# EAGLE design TPS65217A Evaluation Board (EAGLE 9.3.0)
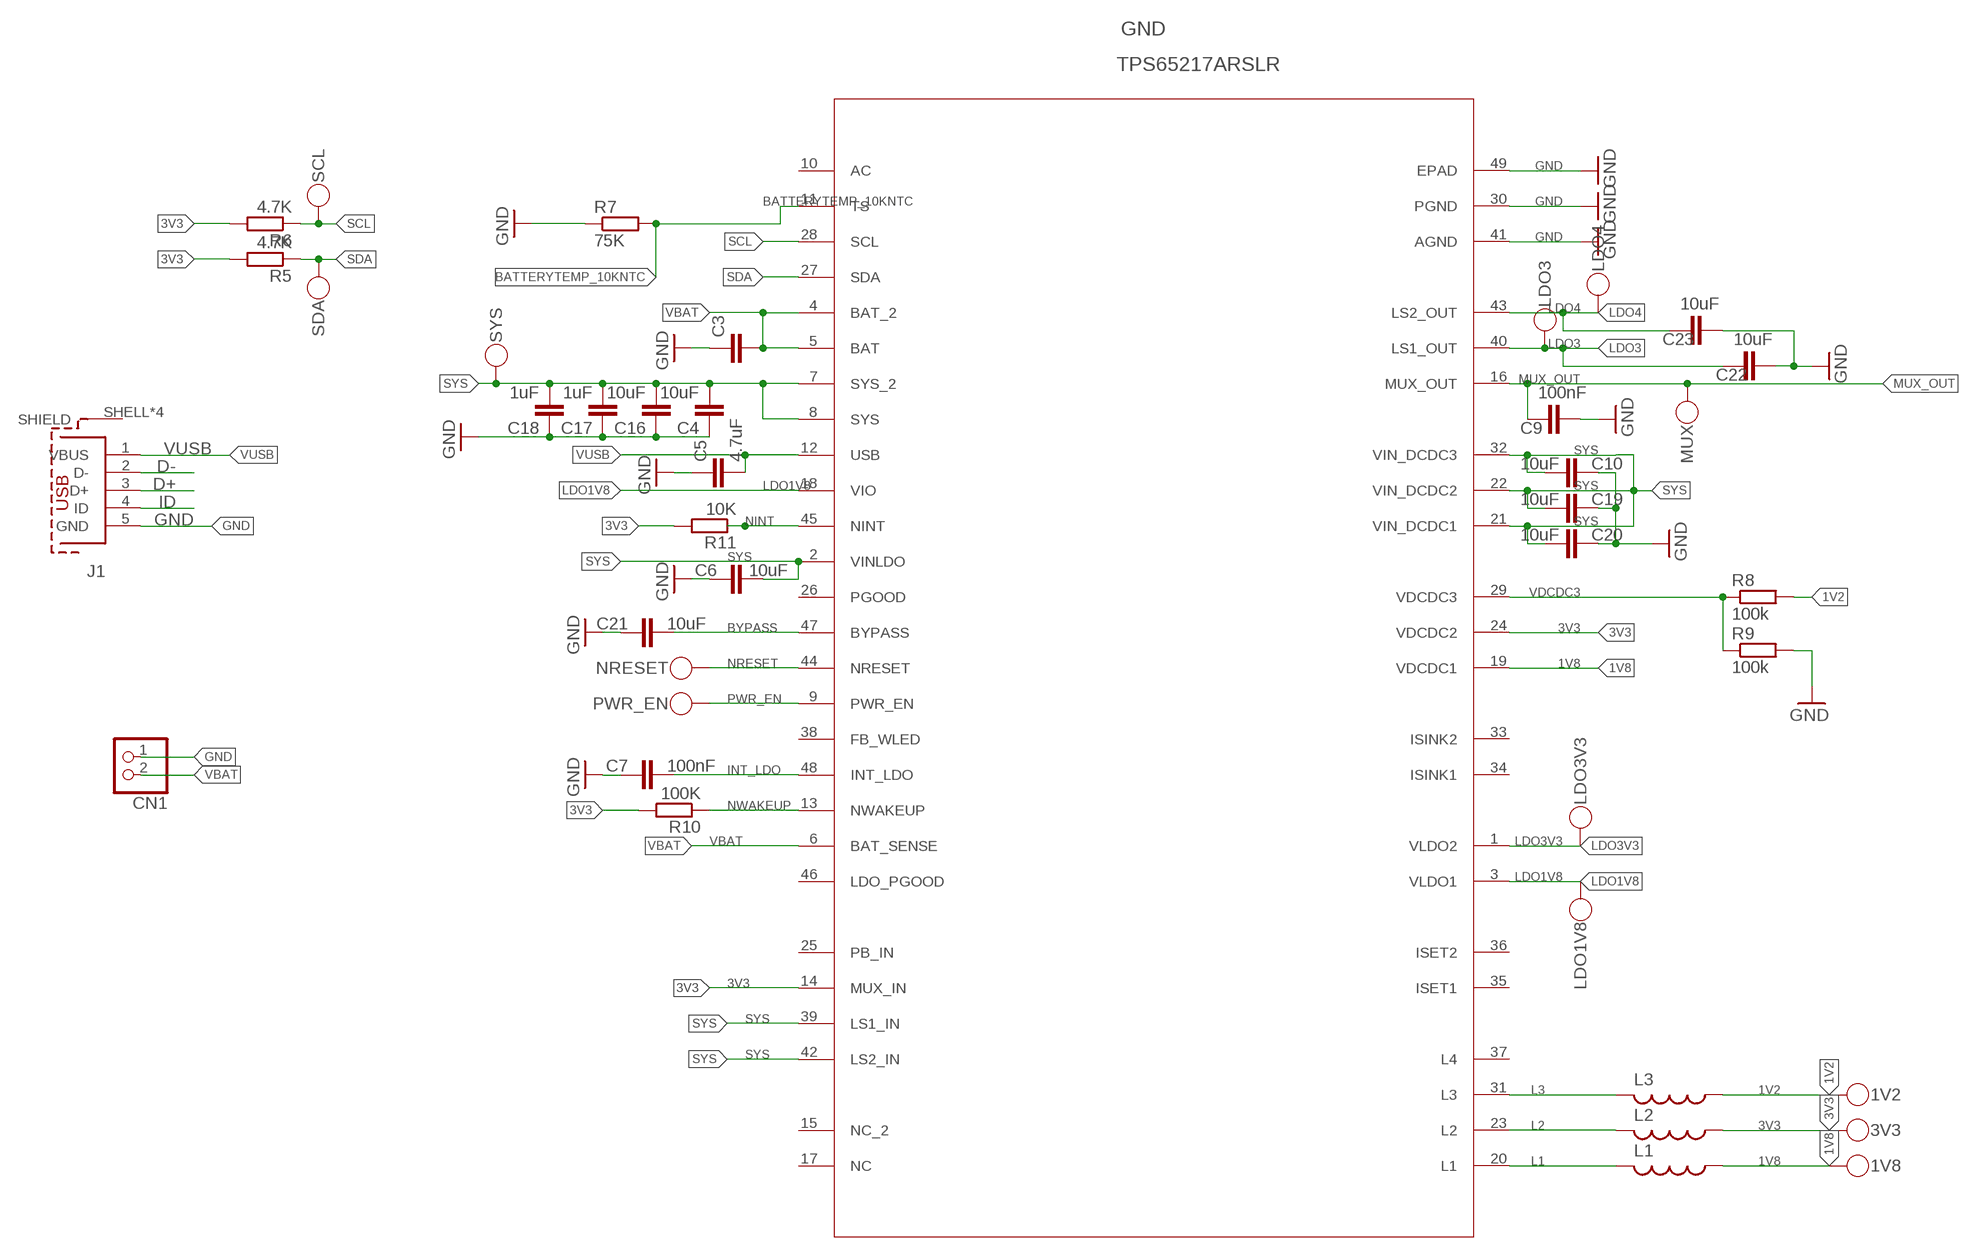
[diagram p0: schematic, sheet 1]

## Parts
1V2  TEST_TESTPOINT  [TEST_TESTPOINT]
1V8  TEST_TESTPOINT  [TEST_TESTPOINT]
3V3  TEST_TESTPOINT  [TEST_TESTPOINT]
C3  C0603  [C0603]
C4  10uF  C0603  [C0603]
C5  4.7uF  C0603  [C0603]
C6  10uF  C0603  [C0603]
C7  100nF  C0603  [C0603]
C9  100nF  C0603  [C0603]
C10  10uF  C0603  [C0603]
C16  10uF  C0603  [C0603]
C17  1uF  C0603  [C0603]
C18  1uF  C0603  [C0603]
C19  10uF  C0603  [C0603]
C20  10uF  C0603  [C0603]
C21  10uF  C0603  [C0603]
C22  10uF  C0603  [C0603]
C23  10uF  C0603  [C0603]
CN1  JST_2PIN-SMT-RA  [JST-PH-2-SMT-RA]
GND  TPS65217ARSLR  [RSL48_4P05X4P05]
J1  629105150521  [629105150521]
L1  L4X4  [ASPI-4030S-253675]
L2  L4X4  [ASPI-4030S-253675]
L3  L4X4  [ASPI-4030S-253675]
LDO1V8  TEST_TESTPOINT  [TEST_TESTPOINT]
LDO3  TEST_TESTPOINT  [TEST_TESTPOINT]
LDO3V3  TEST_TESTPOINT  [TEST_TESTPOINT]
LDO4  TEST_TESTPOINT  [TEST_TESTPOINT]
MUX  TEST_TESTPOINT  [TEST_TESTPOINT]
NRESET  TEST_TESTPOINT  [TEST_TESTPOINT]
PWR_EN  TEST_TESTPOINT  [TEST_TESTPOINT]
R5  4.7K  R0603  [R0603]
R6  4.7K  R0603  [R0603]
R7  75K  R0603  [R0603]
R8  100k  R0603  [R0603]
R9  100k  R0603  [R0603]
R10  100K  R0603  [R0603]
R11  10K  R0603  [R0603]
SCL  TEST_TESTPOINT  [TEST_TESTPOINT]
SDA  TEST_TESTPOINT  [TEST_TESTPOINT]
SYS  TEST_TESTPOINT  [TEST_TESTPOINT]

## Nets
1V2: 1V2.1 L3.P$1 R8.2
1V8: 1V8.1 GND.19(VDCDC1) L1.P$1
3V3: 3V3.1 GND.14(MUX_IN) GND.24(VDCDC2) L2.P$1 R5.2 R6.2 R10.2 R11.2
BATTERYTEMP_10KNTC: GND.11(TS) R7.2
BYPASS: C21.2 GND.47(BYPASS)
D+: J1.3(D+)
D-: J1.2(D-)
GND: C3.1 C4.1 C5.1 C6.1 C7.1 C9.1 C10.1 C16.1 C17.1 C18.1 C19.1 C20.1 C21.1 C22.1 C23.1 CN1.1 GND.30(PGND) GND.41(AGND) GND.49(EPAD) J1.5(GND) R7.1 R9.2
ID: J1.4(ID)
INT_LDO: C7.2 GND.48(INT_LDO)
L1: GND.20(L1) L1.P$2
L2: GND.23(L2) L2.P$2
L3: GND.31(L3) L3.P$2
LDO1V8: GND.3(VLDO1) GND.18(VIO) LDO1V8.1
LDO3: C22.2 GND.40(LS1_OUT) LDO3.1
LDO3V3: GND.1(VLDO2) LDO3V3.1
LDO4: C23.2 GND.43(LS2_OUT) LDO4.1
MUX_OUT: C9.2 GND.16(MUX_OUT) MUX.1
NINT: GND.45(NINT) R11.1
NRESET: GND.44(NRESET) NRESET.1
NWAKEUP: GND.13(NWAKEUP) R10.1
PWR_EN: GND.9(PWR_EN) PWR_EN.1
SCL: GND.28(SCL) R6.1 SCL.1
SDA: GND.27(SDA) R5.1 SDA.1
SYS: C4.2 C6.2 C10.2 C16.2 C17.2 C18.2 C19.2 C20.2 GND.2(VINLDO) GND.7(SYS_2) GND.8(SYS) GND.21(VIN_DCDC1) GND.22(VIN_DCDC2) GND.32(VIN_DCDC3) GND.39(LS1_IN) GND.42(LS2_IN) SYS.1
VBAT: C3.2 CN1.2 GND.4(BAT_2) GND.5(BAT) GND.6(BAT_SENSE)
VDCDC3: GND.29(VDCDC3) R8.1 R9.1
VUSB: C5.2 GND.12(USB) J1.1(VBUS)
Unconnected: GND.10(AC) GND.15(NC_2) GND.17(NC) GND.25(PB_IN) GND.26(PGOOD) GND.33(ISINK2) GND.34(ISINK1) GND.35(ISET1) GND.36(ISET2) GND.37(L4) GND.38(FB_WLED) GND.46(LDO_PGOOD) J1.SHELL1(SHIELD) J1.SHELL2(SHIELD) J1.SHELL3(SHIELD) J1.SHELL(SHIELD)

## Library data of the parts
1V2 1V8 3V3 LDO1V8 LDO3 LDO3V3 LDO4 MUX NRESET PWR_EN SCL SDA SYS = marius:TEST_TESTPOINT; X: X
C3-C7 C9 C10 C16-C23 = marius:C: Capacitor SMD
CN1 = adafruit:JST_2PIN: JST 2-Pin Connectors of various flavors SMT-RA (S2B-PH-SM4) 4UConnector #17311 SMT (B2B-PH-SM4) THM-RA (S2B-PH) THM (B2B-PH)
GND = iframe:TPS65217ARSLR; MANUFACTURER_PART_NUMBER: TPS65217ARSLR; VENDOR: Texas Instruments
J1 = InputOutputIO (rev19a):629105150521: WR-COM_USB_Micro Type B_Horizontal_SMT ; Micro Type B Horizontal SMT - 3A current at Pin1 & Pin 5 - with Pegs and THT shielding Pins - T&R Packaging Code : Con_I-O_COM_USB_2.0_B_629105150521_629105150521 <http://katalog.we-online.de/media/images/eican/Con_I-O_COM_USB_2.0_B_629105150521_pf2.jpg> Details see: http://katalog.we-online.de/em/datasheet/629105150521.pdf Created 12/08/2014, Dan Xu 2014 (C) Wurth Elektronik
L1-L3 = marius:L; MOUSER: 815-ASPI-4030S-150MT; MPN: ASPI-4030S-253675
R5-R11 = marius:R: Resistor SMD

## Board
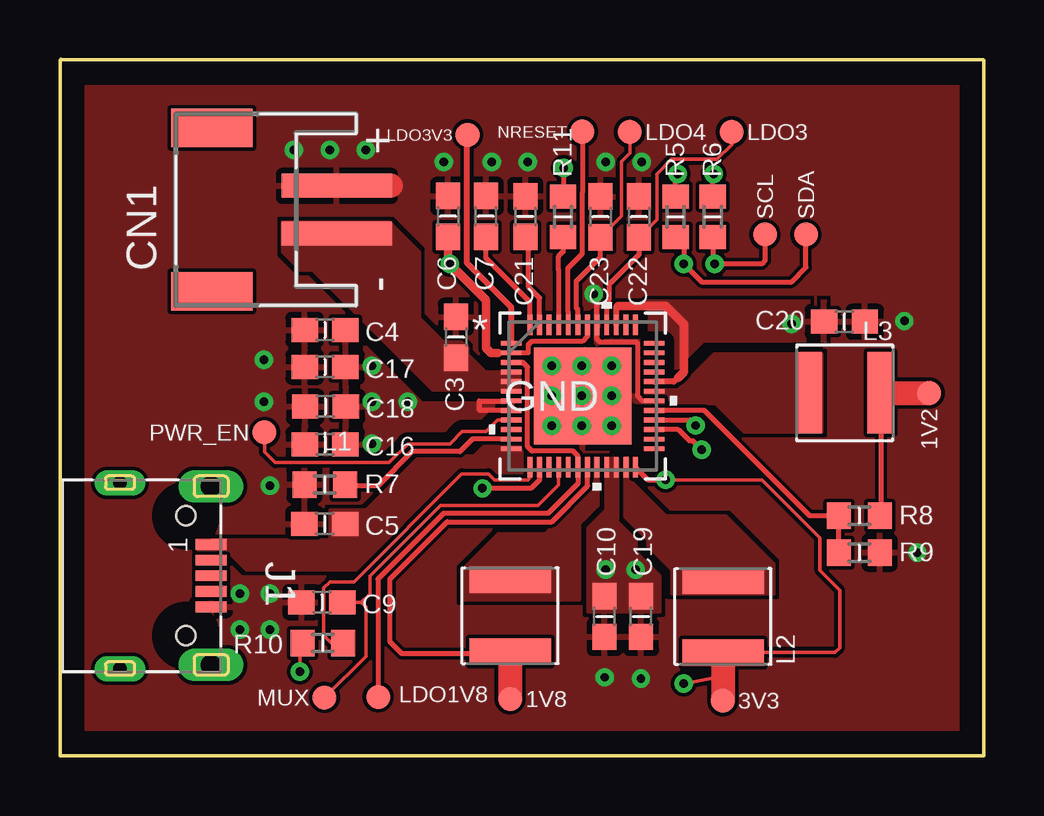
[diagram p1: board, top side]
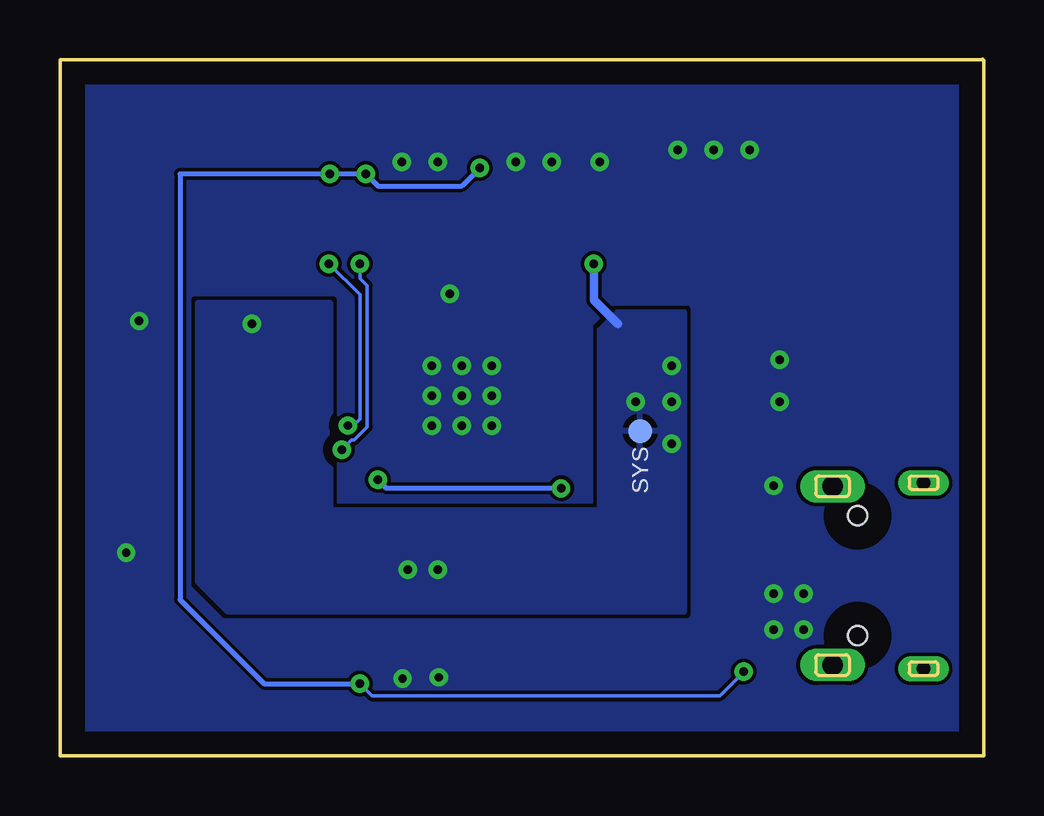
[diagram p2: board, bottom side, seen from below]

Size 38.5 x 29 mm. Coordinates in mm from the lower left corner, seen from the top.
Outline: 0,0 0,29 38.5,29 38.5,0 0,0
Copper layers (1*16): Top 0.035mm / dielectric 1.5mm / Bottom 0.035mm
Design rules "default": minimum track width 6mil, minimum drill 0.35mm, track to track 6mil, track to pad 6mil, pad to pad 6mil, via to via 6mil, smd to smd 6mil, copper to edge 40mil, drill to drill 6mil, minimum pad ring 10mil, minimum via ring 8mil, stop-mask expansion 4mil, vias tented up to drill 0mil, thermal gap 10mil
Milling: area 0,0 to 38.5,29

### Footprints (pad centres in the part's own frame; a part is rotated, then mirrored left to right if it is on the bottom)
TEST_TESTPOINT = smd 1 x 1: 1 0,0
C0603 = smd 1.1 x 1: 1 -0.85,0; 2 0.85,0
JST-PH-2-SMT-RA = smd 1 x 4.6: 1 1,-3.7; 2 -1,-3.7 | smd 1.6 x 3.4: NC1 -3.4,1.5; NC2 3.4,1.5
RSL48_4P05X4P05 = smd 0.85 x 0.2: 1 -2.975,2.2; 2 -2.975,1.8; 3 -2.975,1.4; 4 -2.975,1; 5 -2.975,0.6; 6 -2.975,0.2; 7 -2.975,-0.2; 8 -2.975,-0.6; 9 -2.975,-1; 10 -2.975,-1.4; 11 -2.975,-1.8; 12 -2.975,-2.2; 25 2.975,-2.2; 26 2.975,-1.8; 27 2.975,-1.4; 28 2.975,-1; 29 2.975,-0.6; 30 2.975,-0.2; 31 2.975,0.2; 32 2.975,0.6; 33 2.975,1; 34 2.975,1.4; 35 2.975,1.8; 36 2.975,2.2 | smd 0.2 x 0.85: 13 -2.2,-2.975; 14 -1.8,-2.975; 15 -1.4,-2.975; 16 -1,-2.975; 17 -0.6,-2.975; 18 -0.2,-2.975; 19 0.2,-2.975; 20 0.6,-2.975; 21 1,-2.975; 22 1.4,-2.975; 23 1.8,-2.975; 24 2.2,-2.975; 37 2.2,2.975; 38 1.8,2.975; 39 1.4,2.975; 40 1,2.975; 41 0.6,2.975; 42 0.2,2.975; 43 -0.2,2.975; 44 -0.6,2.975; 45 -1,2.975; 46 -1.4,2.975; 47 -1.8,2.975; 48 -2.2,2.975 | smd 4.05 x 4.05: 49 0,0
629105150521 = smd 0.45 x 1.3: 1 -1.3,1.05; 2 -0.65,1.05; 3 0,1.05; 4 0.65,1.05; 5 1.3,1.05 | drill 0.85 pad 1.2 long: SHELL -3.725,1.05; SHELL1 3.725,1.05 | drill 0.55 pad 0.9 long: SHELL2 -3.875,-2.75; SHELL3 3.875,-2.75 | hole 0.8: -2.5,0; 2.5,0
ASPI-4030S-253675 = smd 1.1 x 3.4: P$1 -1.5,0; P$2 1.5,0
R0603 = smd 1 x 1.1: 1 -0.85,0; 2 0.85,0

### Placement (x,y rotation side)
1V2  36.23,15.11 270 top
1V8  18.77,2.36 0 top
3V3  27.63,2.29 0 top
C3  16.51,17.44 270 top
C4  11.05,17.74 0 top
C5  11.04,9.66 0 top
C6  16.18,22.48 270 top
C7  17.75,22.48 270 top
C9  10.92,6.39 0 top
C10  22.7,5.8 90 top
C16  11.05,12.97 0 top
C17  11.05,16.2 0 top
C18  11.07,14.55 0 top
C19  24.22,5.8 90 top
C20  32.7,18.09 180 top
C21  19.4,22.47 270 top
C22  24.14,22.46 270 top
C23  22.53,22.46 270 top
CN1  7.84,22.76 90 top
GND  21.79,14.99 0 top
J1  5.25,7.5 270 top
L1  18.77,5.83 90 top
L2  27.64,5.8 90 top
L3  32.71,15.12 180 top
LDO1V8  13.27,2.44 180 top
LDO3  28,26 0 top
LDO3V3  16.99,25.88 180 top
LDO4  23.75,26 0 top
MUX  11.03,2.42 180 top
NRESET  21.78,26.01 180 top
PWR_EN  8.53,13.47 180 top
R5  25.66,22.46 90 top
R6  27.21,22.46 90 top
R7  11.04,11.3 0 top
R8  33.32,10 0 top
R9  33.32,8.46 0 top
R10  10.96,4.69 180 top
R11  20.97,22.46 90 top
SCL  29.39,21.72 90 top
SDA  31.1,21.72 90 top
SYS  14.32,13.53 270 bottom

### Tracks (layer width: path | path; a pad name or v marks a point on that pad's centre or on a via)
1V2
  Top 0.2: L3.P$1 34.21,10.04 R8.2
  Top 1: L3.P$1 1V2.1
1V8
  Top 0.2: GND.19 21.99,11.24 20.5,9.75 16.14,9.75 13.75,7.36 13.75,4.75 14.25,4.25 18.69,4.25 L1.P$1
  Top 1: L1.P$1 1V8.1
3V3  (via drill 0.35)
  Top 0.152: v25.25,11.5 29.25,11.5 31.68,9.07 31.68,7.71 32.5,6.89 32.5,4.5 32.3,4.3 L2.P$1 27.64,3.64 27.25,3.25 v26,3 | R10.2 10,4.58 v10,3.5
  Top 0.2: GND.24 24.5,11.5 v25.25,11.5 | GND.14 19.99,11.5 19.63,11.14 v17.61,11.14 | R11.2 21,23.34 v21,24.5 | R5.2 25.66,24.16 v25.75,24.25 | R6.2 27.21,24.21 v27.25,24.25
  Top 1: L2.P$1 3V3.1
  Bottom 0.152: v26,3 25.5,2.5 11,2.5 v10,3.5
  Bottom 0.2: v17.61,11.14 24.89,11.14 v25.25,11.5 | v21,24.5 21.75,23.75 25.25,23.75 v25.75,24.25 v27.25,24.25 33.5,24.25 33.5,6.5 30,3 v26,3
BATTERYTEMP_10KNTC
  Top 0.2: GND.11 17.19,13.19 16.67,12.67 14.67,12.67 13.25,11.25 11.94,11.25 R7.2
BYPASS
  Top 0.2: GND.47 19.99,19.08 19.53,19.53 19.53,21.49 C21.2
GND  (via drill 0.35)
  Top 0.203: v22.25,19.25 22.39,19.11 GND.41 22.39,17.36 22.5,17.25 24,17.25 24.09,17.16 24.09,14.98 24.28,14.79 GND.30
  Top 1.016: 13.79,23.76 CN1.1
  other vias: 35.2,18.12 24.25,24.75 22.75,24.75 19.5,24.75 18,24.75 16,24.75 35.74,8.46 24.22,3.21 22.71,3.26 8.75,5.25 7.5,5.25 7.5,6.75 8.75,6.75 8.75,11.25 8.5,14.75 8.5,16.5 12.75,25.25 11.25,25.25 9.75,25.25 23,13.75 21.75,13.75 20.5,13.75 20.5,15 20.5,16.25 21.75,16.25 21.75,15 23,15 23,16.25
  pour Bottom (rank 6): 38.5,0 38.5,29 0.1,29 0.1,0
  pour Top (rank 6): 38.5,0 38.5,29 0.1,29 0.1,0
INT_LDO
  Top 0.2: GND.48 19.59,18.91 17.75,20.75 C7.2
L1
  pour Top (no thermals): 16.75,6.5 21.65,6.5 21.65,9.66 22.42,10.43 22.42,12.39 22.25,12.39 22.25,11.28 20.22,9.25 18.25,9.25 16.75,7.75
L2
  pour Top (no thermals): 23.55,12.4 23.75,12.4 23.75,11.5 25.25,10 27.75,10 29.75,8 29.75,6.75 25.5,6.75 25.5,7.75 24.5,8.75 24.5,9 23.55,9.95
L3
  Top 0.61: L3.P$2 31.14,15.19
  pour Top (no thermals): 24.25,15 24.25,15.25 25.75,15.25 27.25,16.75 31.75,16.75 31.75,13.5 28.5,13.5 27.33,14.67 25.58,14.67 25.25,15
LDO1V8
  Top 0.2: GND.3 19.3,16.39 19.49,16.2 19.49,12.88 19.68,12.69 21.39,12.69 21.59,12.5 GND.18 21.59,11.34 20.35,10.1 16,10.1 13.25,7.35 13.25,2.46 LDO1V8.1
LDO3
  Top 0.152: LDO3.1 28,25.47 27.39,24.86 25.5,24.86 24.88,24.24 24.88,22.35 C22.2
  Top 0.2: C22.2 24.14,20.89 22.88,19.63 22.88,18.99 22.79,18.9 GND.40
LDO3V3
  Top 0.254: GND.1 18.81,18.69 16.97,20.53 16.97,25.86 LDO3V3.1
LDO4
  Top 0.152: LDO4.1 23.75,25.11 23.41,24.77 23.41,22.49 C23.2
  Top 0.2: GND.43 21.59,18.6 21.53,18.66 21.53,19.78 22.53,20.78 C23.2
MUX_OUT
  Top 0.152: GND.16 20.79,11.29 19.93,10.43 15.86,10.43 12.92,7.49 12.92,6.75 12.56,6.39 | C9.2 12.56,6.39 | 12.56,6.39 12.75,6.2 12.75,4.14 MUX.1
NINT
  Top 0.2: R11.1 20.97,21 20.77,20.8 20.77,20.28 20.79,20.26 GND.45
NRESET
  Top 0.2: GND.44 21.19,18.5 21.18,18.51 21.18,20.32 21.78,20.92 21.8,26.03 NRESET.1
NWAKEUP
  Top 0.152: R10.1 11.31,4.69 10.99,5.01 10.99,6.98 11.26,7.25 12.25,7.25 16.75,11.75 17.86,11.75 18.11,11.5 19.5,11.5 19.59,11.59 GND.13
PWR_EN
  Top 0.152: GND.9 18.24,13.99 17.77,13.52 16.77,13.52 16.25,13 14.5,13 13.71,12.21 8.97,12.21 8.53,12.65 PWR_EN.1
SCL  (via drill 0.35)
  Top 0.2: GND.28 26.27,13.99 v26.5,13.76 | SCL.1 29.39,20.64 29.25,20.5 v27.29,20.5 27.21,20.58 R6.1
  Bottom 0.152: v26.5,13.76 26.47,13.79 26.25,13.79 26,14.04 26,19.21 v27.29,20.5
SDA  (via drill 0.35)
  Top 0.2: v26.75,12.75 26.37,13.13 26.24,13.13 25.78,13.59 GND.27 | SDA.1 31.1,20.35 30.5,19.75 26.75,19.75 v26,20.5 26,21.27 R5.1
  Bottom 0.152: v26.75,12.75 26.35,13.15 26.25,13.15 25.69,13.71 25.69,19.59 26,19.89 v26,20.5
SYS  (via drill 0.35)
  Top 0.2: GND.2 18.25,16.79
  Top 0.203: GND.7 17.47,14.79 17.47,14.39 GND.8 | GND.42 21.99,17.48 21.78,17.27 19.66,17.27 19.51,17.12 19.51,16.79 GND.2
  Top 0.254: GND.39 23.19,18.69 23.25,18.75 | 25.75,15.75 25.59,15.59 GND.32
  Top 0.35: 23.25,18.75 25.25,18.75 26,18 26,16 25.75,15.75 | C6.2 16.18,20.57 v16.25,20.5 17.75,19 17.75,17 17.96,16.79 18.25,16.79
  Bottom 0.35: v16.25,20.5 16.25,19 15.25,18
  other vias: 13,16.25 13,14.75 13,13 14.5,14.75 22.75,7.75 24,7.75 30.5,18
  pour Top (no thermals): 22,6 25,6 25,7.5 24,8.5 24,9 23.23,9.77 23.23,12.38 22.75,12.38 22.75,10.25 22,9.5
  pour Bottom (isolate 0.406): 12.5,6 31.5,6 32.75,7.25 32.75,18.88 27.25,18.88 27.25,10.25 16,10.25 16,17.75 15.25,18.5 12.5,18.5
  pour Top (isolate 0.406, rank 2): 11.5,6 31.5,6 32.75,7.25 32.75,18.88 24.5,18.88 24.5,12.5 19.25,12.5 19.25,14.5 15.25,18.5 11.5,18.5
VBAT
  pour Top (no thermals): 19.25,15.25 19.25,16 17.75,16 17,16.75 17,17 16.75,17.25 16,17.25 15,18.25 15,21 13.75,22.25 9.25,22.25 9.25,21 10,20.25 10.5,20.25 15.5,15.25
VDCDC3
  Top 0.2: R9.1 R8.1 31.25,10 26.86,14.39 GND.29
VUSB
  Top 0.2: C5.2 12.15,9.4
  pour Top (no thermals): 19.25,13 18.25,13 17.75,13 17.25,12.5 15,12.5 12.75,10.25 11.25,10.25 11.25,9 5.75,9 5.75,8.5 7,8.5 7.5,8 7.75,7.75 13,7.75 13.25,8 16,10.75 16.75,10.75 17,11 19.25,11